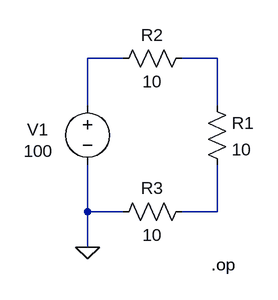
[diagram p0: schematic Lecture1_Ex1.asc]
Lecture1_Ex1.asc, the LTspice schematic file:
Version 4
SHEET 1 880 680
WIRE 112 80 64 80
WIRE 240 80 192 80
WIRE 64 144 64 80
WIRE 240 144 240 80
WIRE 64 288 64 224
WIRE 112 288 64 288
WIRE 240 288 240 224
WIRE 240 288 192 288
WIRE 64 336 64 288
FLAG 64 336 0
SYMBOL voltage 64 128 R0
WINDOW 0 -82 49 Left 2
WINDOW 3 -87 78 Left 2
WINDOW 123 0 0 Left 0
WINDOW 39 0 0 Left 0
SYMATTR InstName V1
SYMATTR Value 100
SYMBOL res 224 128 R0
SYMATTR InstName R1
SYMATTR Value 10
SYMBOL res 208 64 R90
WINDOW 0 0 56 VBottom 2
WINDOW 3 32 56 VTop 2
SYMATTR InstName R2
SYMATTR Value 10
SYMBOL res 208 272 R90
WINDOW 0 0 56 VBottom 2
WINDOW 3 32 56 VTop 2
SYMATTR InstName R3
SYMATTR Value 10
TEXT 232 360 Left 2 !.op

The netlist it stands for:
* Lecture1_Ex1.asc
V1 N001 0 100
R1 N002 N003 10
R2 N002 N001 10
R3 N003 0 10
.op
.backanno
.end